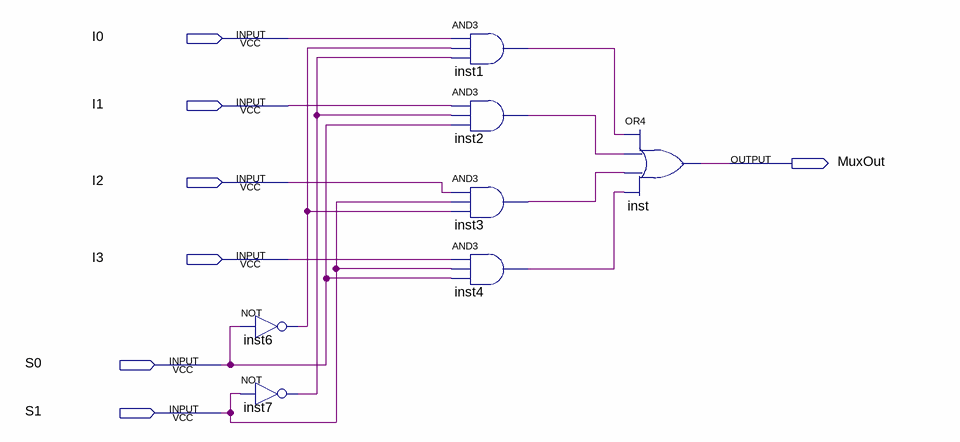
[diagram p0: schematic sheet]
// Quartus schematic mux4a1.bdf as structural Verilog: 7 symbols, 7 pins
module mux4a1 (
  input  I0,
  input  I1,
  input  I2,
  input  I3,
  input  S0,
  input  S1,
  output MuxOut
);

  wire inst1_out, inst2_out, inst3_out, inst4_out, inst6_out, inst7_out;

  not inst6 (inst6_out, S0);
  not inst7 (inst7_out, S1);
  and inst1 (inst1_out, I0, inst6_out, inst7_out);
  and inst2 (inst2_out, I1, inst7_out, S0);
  and inst3 (inst3_out, I2, S1, inst6_out);
  and inst4 (inst4_out, I3, S1, S0);
  or inst (MuxOut, inst1_out, inst2_out, inst3_out, inst4_out);
endmodule
